# EAGLE schematic PCB programador PIC12F683 (EAGLE 5.07)
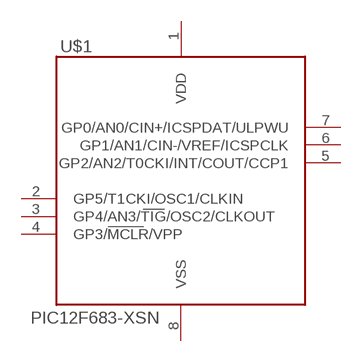
[diagram p0: schematic, sheet 1]

## Parts
U$1  PIC12F683.  [PIC12F683_PATRON_RECOMENDADO]
Unconnected: U$1.2(GP5/T1CKI/OSC1/CLKIN) U$1.3(GP4/AN3/TIG/OSC2/CLKOUT) U$1.4(GP3/MCLR/VPP) U$1.5(GP2/AN2/T0CKI/INT/COUT/CCP1) U$1.6(GP1/AN1/CIN-/VREF/ICSPCLK) U$1.7(GP0/AN0/CIN+/ICSPDAT/ULPWU)

## Power pins joined to a net without a drawn wire
VDD: U$1.1(VDD)
VSS: U$1.8(VSS)

## Library data of the parts
U$1 = PIC 12F683:PIC12F683